# Altium project GRF2071_testboard_lowband.PrjPcb
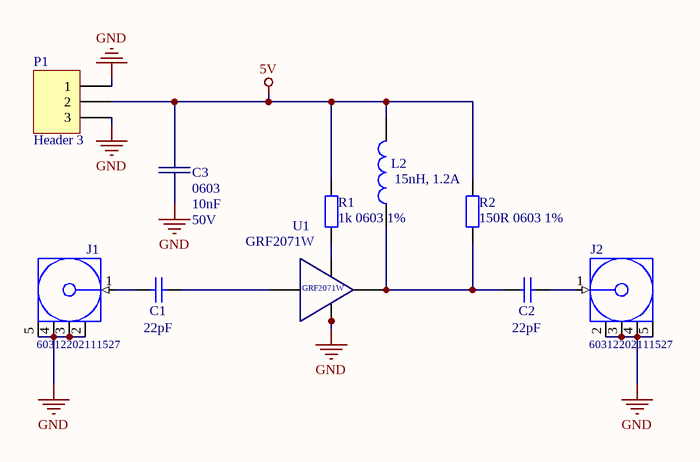
[diagram p0: GRF2071_testboard.SchDoc]
1 sheet, 10 parts. Net scope: global (net labels, ports and power ports of the same name join across sheets).
Board file: GRF2071_testboard.PcbDoc

## Sheet GRF2071_testboard.SchDoc
size A4; SheetNumber: 1; SheetTotal: 1

### Parts
C1  22pF  [WCAP-CSRF_0402_L1W0.5H0.5]
C2  22pF  [WCAP-CSRF_0402_L1W0.5H0.5]
C3  Case Code (Imperial): 0603  Capacitance: 10nF  Voltage: 50V  [C0603_murata]  (hidden comment: 10nF 0603 NP0)
J1  60312202111527  [60312202111527]
J2  60312202111527  [60312202111527]
L2  15nH, 1.2A  [WE-KI HC_0603]
P1  Header 3  [HDR1X3]
R1  1k 0603 1%  [R0603]
R2  150R 0603 1%  [R0603]
U1  GRF2071W  [GRF_DFN8_2x2mm]

### Nets
5V: C3.2 L2.2 P1.2 R1.2 R2.2
GND: C3.1 J1.2(GND) J1.3(GND) J1.4(GND) J1.5(GND) J2.2(GND) J2.3(GND) J2.4(GND) J2.5(GND) P1.1 P1.3 U1.3(GND) U1.4(GND) U1.5(GND) U1.8(GND) U1.9(GND)
NetC1_1: C1.1 J1.1(Signal)
NetC1_2: C1.2 U1.2(RF_In)
NetC2_1: C2.1 L2.1 R2.1 U1.7(RF_Out)
NetC2_2: C2.2 J2.1(Signal)
NetR1_1: R1.1 U1.1(Venable)

### Library data of the parts
C1 C2 = 885392005114: WCAP-CSRF Multilayer Ceramic Chip Capacitor, High Frequency, 0402, NP0 Class I, 22pF, 50VDC; Manufacturer: Wurth Elektronik; Case/Size Code: 0402; Capacitance Tolerance: +/-5%; Insulation Resistance: 10GOhm; Q Factor: 840; Rated Voltage (DC): 50V; Technical Reference: NP00402220J050DFCT1R000; ComponentLink1Description: Manufacturer Link; ComponentLink1URL: https://www.we-online.com/redexpert/article/885392005114?ad; ComponentLink2Description: Datasheet; ComponentLink2URL: https://www.we-online.com/redexpert/spec/885392005114?ad; Category: Multilayer Ceramic Chip Capacitors; Match Code: WCAP-CSRF; Manufacturer Part Number: 885392005114; Mount: Surface Mount; Operating Temperature Max: 125°C; Operating Temperature Min: -55°C; Packaging: Tape and Reel; Length: 1mm; Width: 0.5mm; Height: 0.5mm; Capacitance: 22pF; Ceramic Type: NP0 Class I
C3 = CAP 10nF 0603 NP0: 10nF 0603 NP0 muRata; Manufacturer Part Number 1: GRM1885C1H103JA01D; Material: Ceramic; Tolerance: 5%; Dielectric: C0G; Supplier 1: Mouser; Manufacturer 1: Murata; Stock 1: 5; Pricing 1: 1=0.13, 10=0.05, 50=0.05, 100=0.035, 1000=0.024, 10000=0.016 (USD); Case/Package: 0603; Case Code (Metric): 1608; Min Operating Temperature: -55°C; Max Operating Temperature: 125°C; Packaging: Tape and Reel; Package Quantity: 4000; Voltage Rating: 50V; Voltage Rating (DC): 50V; Termination: SMD/SMT; Length: 1.6mm; Height: 0.8mm; Width: 0.8mm; Thickness: 0.035inch; Lead Pitch: 0.5mm; Depth: 0.8mm; REACH SVHC: No SVHC; Lead Free: Lead Free; ComponentLink1URL: https://datasheet.ciiva.com/41860/partnumbering-e-01-41860759.pdf; ComponentLink1Description: https://datasheet.ciiva.com/41860/partnumbering-e-01-41860759.pdf; ComponentLink2URL: https://datasheet.ciiva.com/29537/partnumbering-e-01-29537910.pdf; ComponentLink2Description: https://datasheet.ciiva.com/29537/partnumbering-e-01-29537910.pdf; Supplier Part Number 1: 81-GRM1885C1H103JA1D
J1 J2 = 60312202111527: WR-SMA Connector, PCB End Launch Jack, 6.35SQ Flange Round Post for PCB 1.6mm, DC~18GHz, 50Ohm; Manufacturer: Wurth Elektronik; Connector Type: SMA; Orientation Type: Straight; Interface: MIL-STD-348; Center Contact Diameter: 0.76mm; ComponentLink1Description: Manufacturer; ComponentLink1URL: http://www.we-online.de; ComponentLink2Description: Datasheet; ComponentLink2URL: https://www.we-online.com/catalog/datasheet/60312202111527.pdf; Manufacturer Part Number: 60312202111527; Published Date: November 2021; Operating Temperature: -65 to +165degC; Gender: Jack; Impedance: 50Ohm; Packaging: Tray; Frequency Range: DC~18GHz; Mounting Technology: End Launch
L2 = 744917115: WE-KI HC SMT High Current Wire Wound Ceramic Inductor, size 0603, 15nH, 1.2A; Manufacturer: Wurth Elektronik; Case/Size Code: 0603; Inductance Tolerance: +/-2%; DC Resistance Max: 0.078Ohm; Self Resonant Frequency: 3600MHz; Q Factor: 38; ComponentLink1Description: Manufacturer Link; ComponentLink1URL: http://www.we-online.de; ComponentLink2Description: Datasheet; ComponentLink2URL: https://www.we-online.com/catalog/datasheet/744917115.pdf; Manufacturer Part Number: 744917115; Mount: SMT; Operating Temperature Max: 125°C; Operating Temperature Min: -40°C; Packaging: Tape and Reel; Category: RF Inductors; Match Code: WE-KI HC; Length: 1.7mm; Width: 1.1mm; Height: 0.9mm; Inductance: 15nH; Rated Current: 1.2A
P1 = Header 3: Header, 3-Pin; LatestRevisionDate: 17-Jul-2002; LatestRevisionNote: Re-released for DXP Platform.; Publisher: Altium Limited
R1 = RES 1k 0603: Value: 1k; Case: 0603; Tolerance: 1%; Publisher: iv
R2 = RES 150R 0603: Value: 150R; Case: 0603; Tolerance: 1%; Publisher: iv
U1 = GRF2071W: 0.7 - 2.7 GHz Ultra-Low Noise Amplifier AEC-Q100; Manufacturer 1: GuerillaRF; Manufacturer Part Number 1: GRF2071-W; Number of Channels: 1; Supply Voltage: 5V; Gain: 19dB; P1dB: +21dBm; Stock 1: 0; Mount: Surface Mount; Case/Package: DFN8; Frequency: 0.7 - 2.7 GHz; Radiation Hardening: No; ComponentLink1URL: https://www.verical.com/server-webapp/html/getDatasheet?partID=559390; ComponentLink1Description: https://www.verical.com/server-webapp/html/getDatasheet?partID=559390; Supplier Part Number 1: 459-GRF2071W; Supplier 1: Mouser